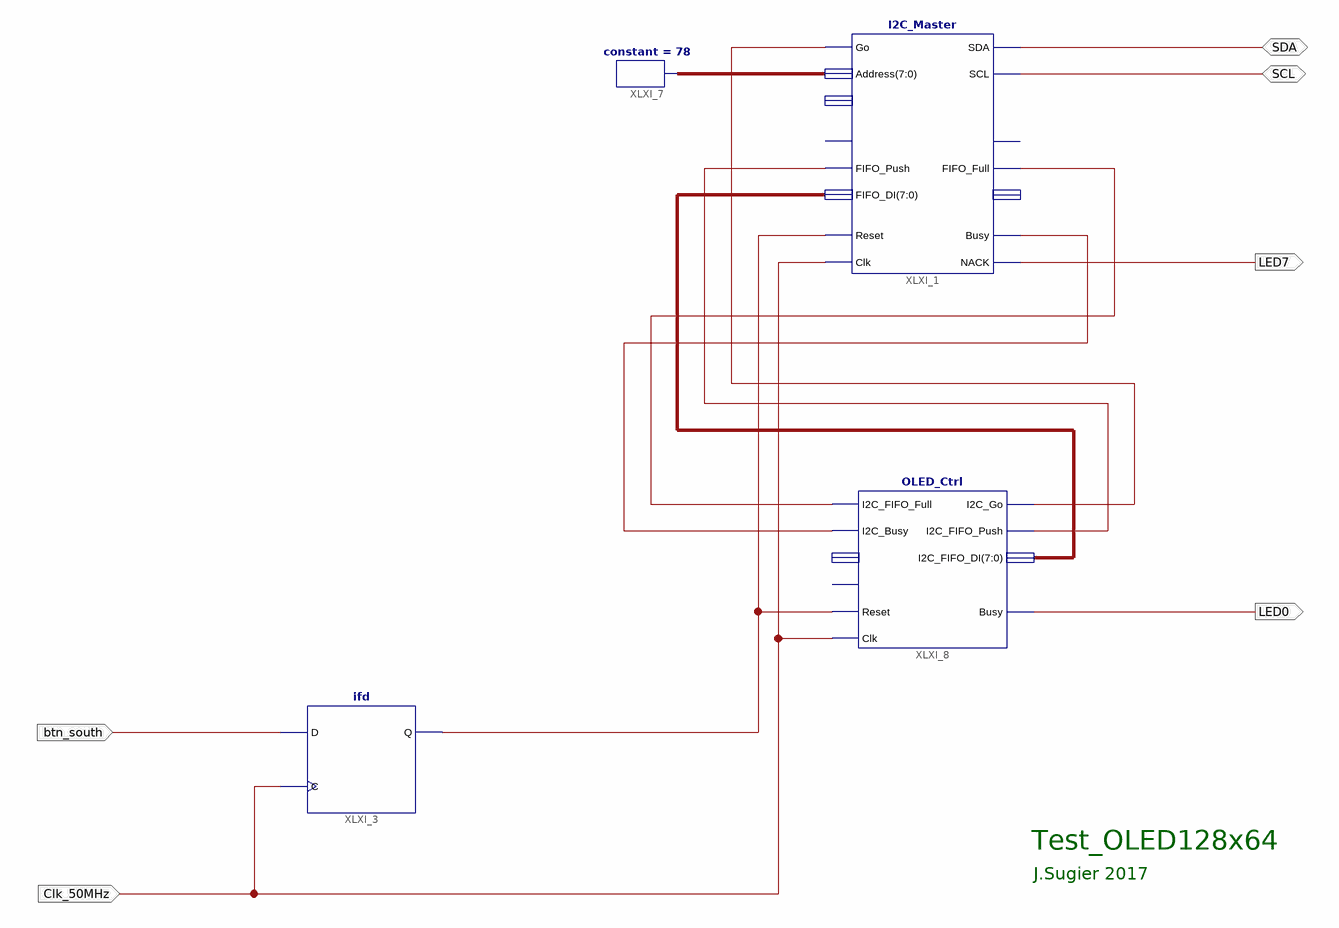
[diagram p0: schematic sheet 1]
// Xilinx ISE schematic top.sch (spartan3e) as structural Verilog: 4 symbols, 6 ports
module top (
  input  btn_south,
  input  Clk_50MHz,
  inout  SDA,
  inout  SCL,
  output LED7,
  output LED0
);

  wire XLXN_12, XLXN_21, XLXN_23, XLXN_25, XLXN_53;
  wire [7:0] XLXN_51, XLXN_95;

  constant #(.CValue("78")) XLXI_7 (.O(XLXN_95));
  I2C_Master XLXI_1 (
    .Go(XLXN_21), .Address(XLXN_95), .SDA(SDA), .SCL(SCL), .FIFO_Push(XLXN_23), .FIFO_DI(XLXN_51),
    .FIFO_Full(XLXN_53), .Reset(XLXN_12), .Clk(Clk_50MHz), .Busy(XLXN_25), .NACK(LED7));  // open: ReadCnt, FIFO_Pop, FIFO_Empty, FIFO_DO
  OLED_Ctrl XLXI_8 (
    .Clk(Clk_50MHz), .Reset(XLXN_12), .I2C_FIFO_Full(XLXN_53), .I2C_Busy(XLXN_25), .I2C_Go(XLXN_21),
    .I2C_FIFO_Push(XLXN_23), .I2C_FIFO_DI(XLXN_51), .Busy(LED0));  // open: WriteByte, Byte
  ifd XLXI_3 (.C(Clk_50MHz), .D(btn_south), .Q(XLXN_12));

  // Notes on the sheet:
  //   Test_OLED128x64
  //   J.Sugier 2017
endmodule
